# Altium schematic sheet GEARDRONE_F4_4.SchDoc
size A3
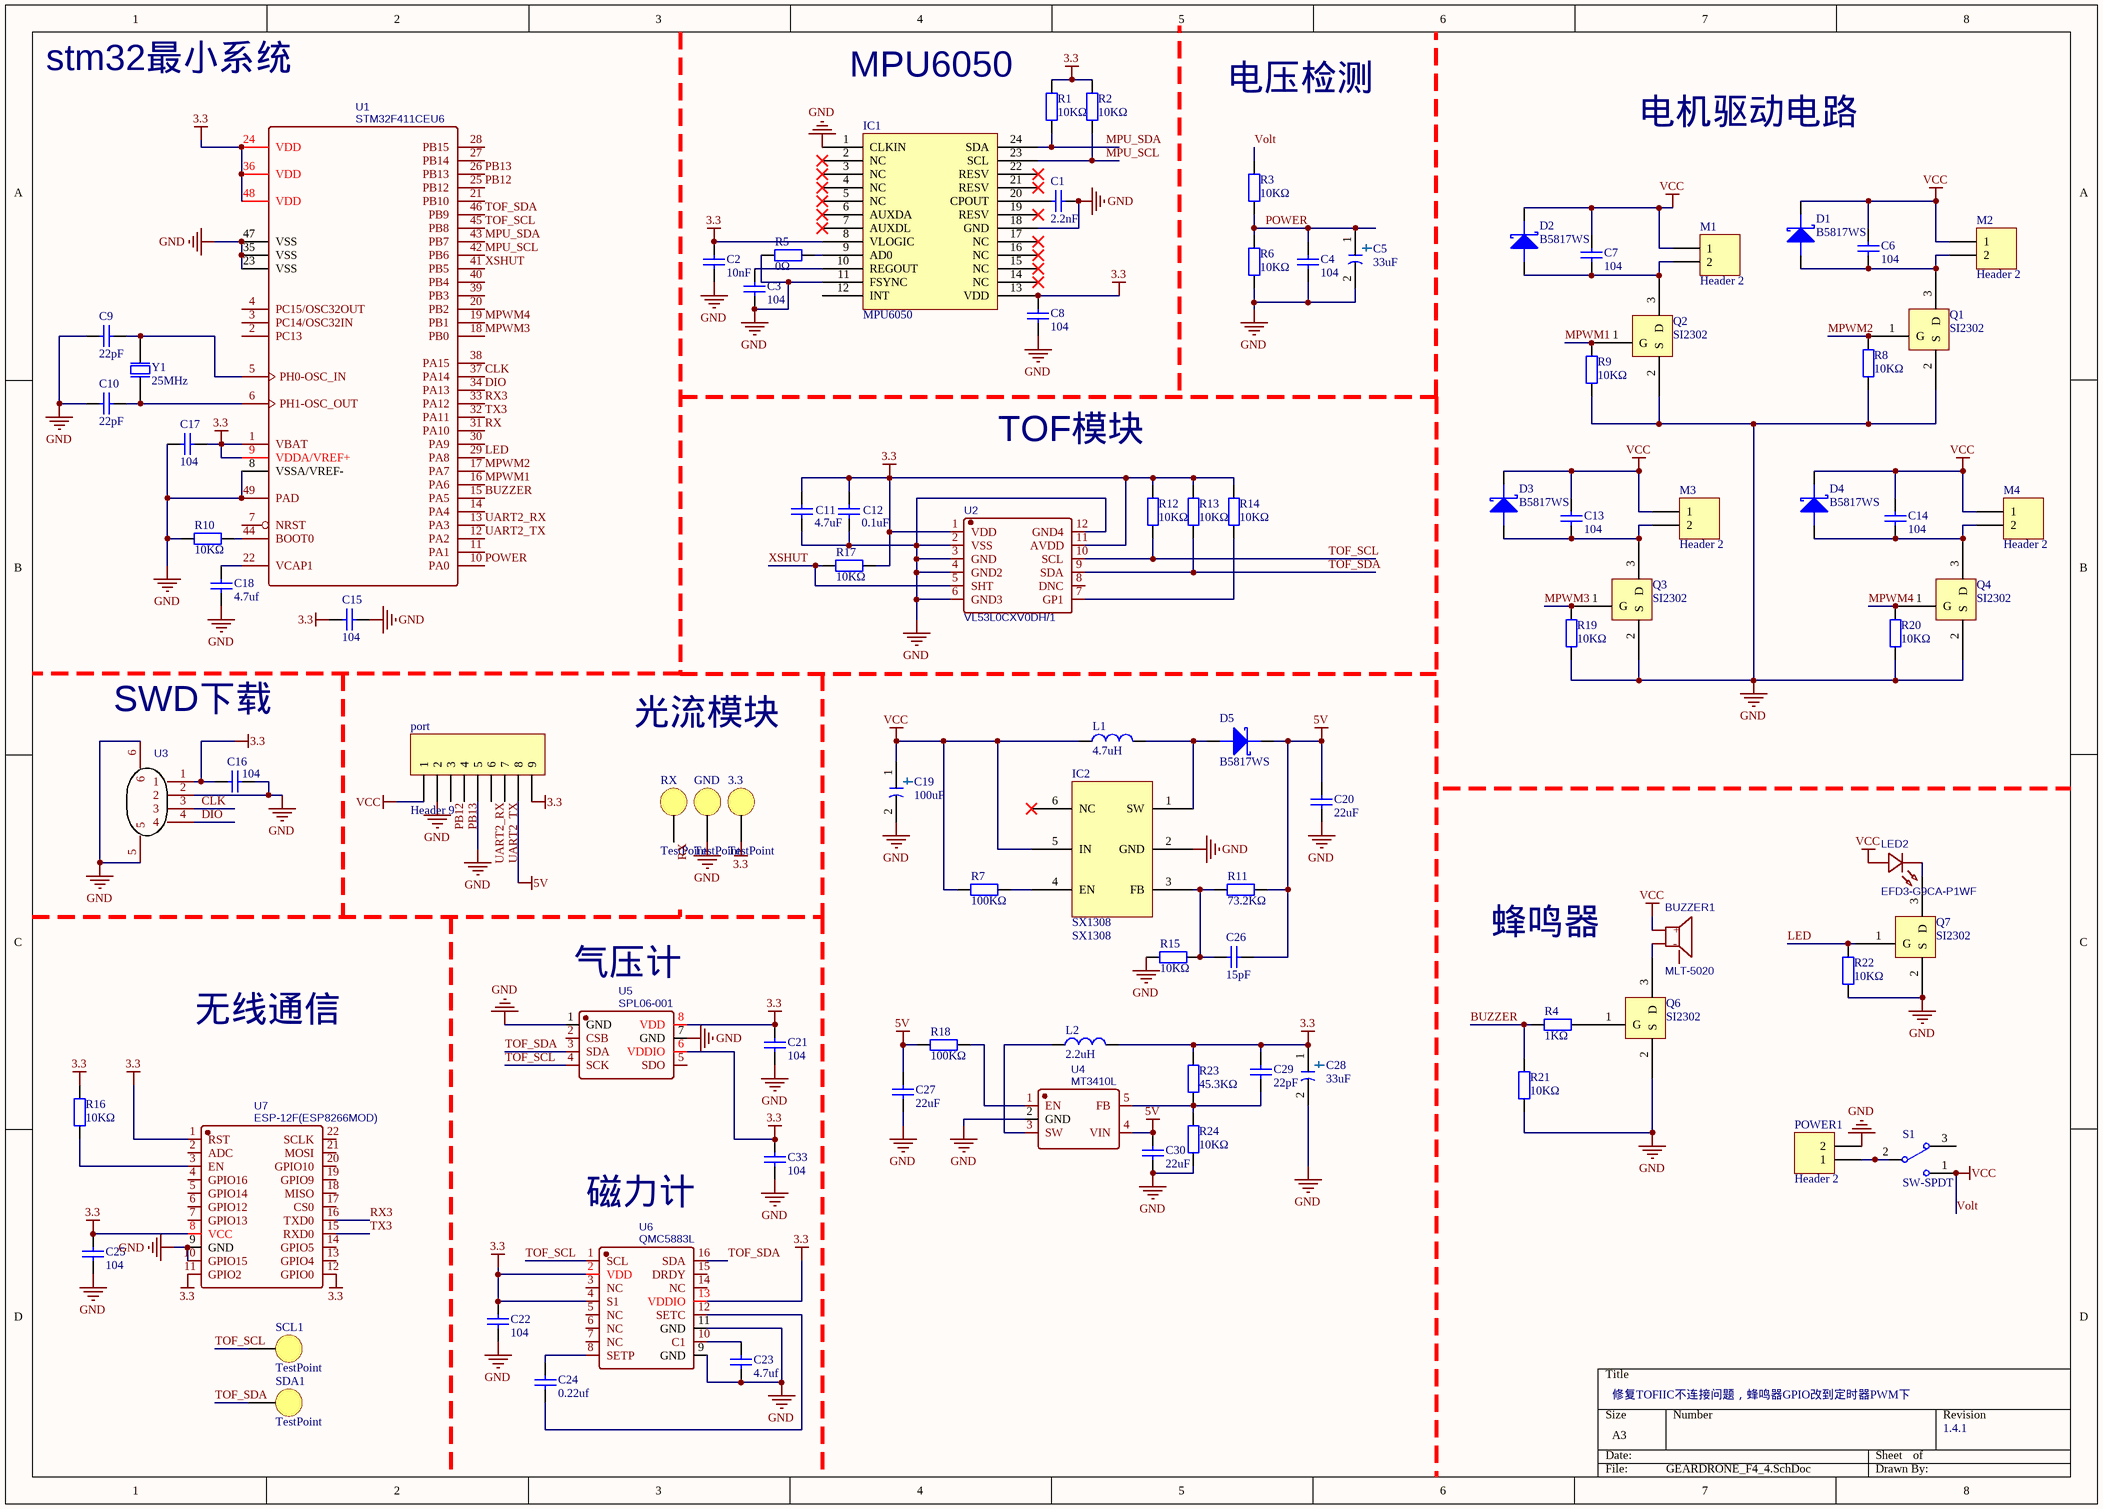
[diagram p0: GEARDRONE_F4_4.SchDoc]

## Parts
3.3  TestPoint  [TestPoint]
BUZZER1  MLT-5020  [BUZ-SMD_3P-L5.2-W5.2-P3.50-BR]
C1  2.2nf  [0603_C]
C2  10nf  [0603_C]
C3  104  [0603_C]
C4  104  [0603_C]
C5  33uf  [CASE-B_3528]
C6  104  [0603_C]
C7  104  [0603_C]
C8  104  [0603_C]
C9  22pf  [0603_C]
C10  22pf  [0603_C]
C11  4.7uf  [0603_C]
C12  0.1uf  [0603_C]
C13  104  [0603_C]
C14  104  [0603_C]
C15  104  [0603_C]
C16  104  [0603_C]
C17  104  [0603_C]
C18  4.7uf  [0603_C]
C19  100uf  [CASE-B_3528]
C20  22uf  [0603_C]
C21  104  [0603_C]
C22  104  [0603_C]
C23  4.7uf  [0603_C]
C24  0.22uf  [0603_C]
C25  104  [0603_C]
C26  15pf  [0603_C]
C27  22uF  [0603_C]
C28  33uf  [CASE-B_3528]
C29  22pF  [0603_C]
C30  22uF  [0603_C]
C33  104  [0603_C]
D1  B5817WS  [SOD-323]
D2  B5817WS  [SOD-323]
D3  B5817WS  [SOD-323]
D4  B5817WS  [SOD-323]
D5  B5817WS  [SOD-323]
GND  TestPoint  [TestPoint]
IC1  MPU6050  [LC-QFN-24_4x4x05P]
IC2  SX1308  [LC-SOT-23-6]
L1  4.7uH  [CD43NP]
L2  2.2uH  [IND-SMD_L3.0-W3.0]
LED2  EFD3-G9CA-P1WF  [LED3528]
M1  Header 2  [HDR1X2]
M2  Header 2  [HDR1X2]
M3  Header 2  [HDR1X2]
M4  Header 2  [HDR1X2]
port  Header 9  [HDR1X9]
POWER1  Header 2  [HDR1X2]
Q1  SI2302  [LC-SOT-23(SOT-23-3)]
Q2  SI2302  [LC-SOT-23(SOT-23-3)]
Q3  SI2302  [LC-SOT-23(SOT-23-3)]
Q4  SI2302  [LC-SOT-23(SOT-23-3)]
Q6  SI2302  [LC-SOT-23(SOT-23-3)]
Q7  SI2302  [LC-SOT-23(SOT-23-3)]
R1  value 10KΩ  [0603_R]  (hidden comment: 10k)
R2  value 10KΩ  [0603_R]  (hidden comment: 10k)
R3  value 10KΩ  [0603_R]  (hidden comment: 10k)
R4  value 1KΩ  [0603_R]  (hidden comment: 1k)
R5  value 0Ω  [0603_R]  (hidden comment: 0)
R6  value 10KΩ  [0603_R]  (hidden comment: 10k)
R7  value 100KΩ  [0603_R]  (hidden comment: 100k)
R8  value 10KΩ  [0603_R]  (hidden comment: 10k)
R9  value 10KΩ  [0603_R]  (hidden comment: 10k)
R10  10kΩ  [0603_R]
R11  value 73.2KΩ  [0603_R]  (hidden comment: 73.2k)
R12  value 10KΩ  [0603_R]  (hidden comment: 10k)
R13  value 10KΩ  [0603_R]  (hidden comment: 10k)
R14  value 10KΩ  [0603_R]  (hidden comment: 10k)
R15  value 10KΩ  [0603_R]  (hidden comment: 10k)
R16  value 10KΩ  [0603_R]  (hidden comment: 10k)
R17  value 10KΩ  [0603_R]  (hidden comment: 10k)
R18  value 100KΩ  [0603_R]  (hidden comment: 100k)
R19  value 10KΩ  [0603_R]  (hidden comment: 10k)
R20  value 10KΩ  [0603_R]  (hidden comment: 10k)
R21  value 10KΩ  [0603_R]  (hidden comment: 10k)
R22  value 10KΩ  [0603_R]  (hidden comment: 10k)
R23  45.3KΩ  [0603_R]
R24  10KΩ  [0603_R]
RX  TestPoint  [TestPoint]
S1  SW-SPDT  [8.5*3.5_3P]
SCL1  TestPoint  [TestPoint]
SDA1  TestPoint  [TestPoint]
U1  STM32F411CEU6  [UFQFPN-48_L7.0-W7.0-P0.50-BL-EP]
U2  VL53L0CXV0DH/1  [OPTO-SMD_12P_VL53L0CXV0DH-1]
U3  SM04B-GHS-TB(LF)(SN)  [CONN-SMD_4P-P1.25_SM04B-GHS-TB-LF-SN]  (value not drawn)
U4  MT3410L  [SOT-23-5_L2.9-W1.6-P0.95-LS2.8-BL]
U5  SPL06-001  [SENSOR-SMD_SPL06-001]
U6  QMC5883L  [LPCC-16_L3.0-W3.0-P0.50-BL]
U7  ESP-12F(ESP8266MOD)  [WIFIM-SMD_ESP-12F-ESP8266MOD]
Y1  Frequency: 25MHz  [SMD-5032_2P]  (hidden comment: 25MHZ 5032)

## Nets
3.3: 3.3.1(TestPoint) C2.2 C8.1 C11.2 C12.2 C15.2 C16.2 C17.1 C21.1 C22.1 C25.1 C28.1 C29.1 C33.1 IC1.8(VLOGIC) IC1.13(VDD) L2.2 port.9 R1.1 R2.1 R12.1 R13.1 R14.1 R16.1 R17.2 R23.2 U1.1(VBAT) U1.9(VDDA/VREF+) U1.24(VDD) U1.36(VDD) U1.48(VDD) U2.1(VDD) U2.11(AVDD) U3.1 U5.6(VDDIO) U5.8(VDD) U6.2(VDD) U6.4(S1) U6.13(VDDIO) U7.1(RST) U7.8(VCC) U7.11(GPIO2) U7.12(GPIO0)
5V: C20.2 C26.1 C27.2 C30.2 D5.2(K) port.8 R11.2 R18.1 U4.4(VIN)
GND: C1.2 C2.1 C3.2 C4.2 C5.2 C8.2 C9.1 C10.1 C11.1 C12.1 C15.1 C16.1 C17.2 C18.2 C19.2 C20.1 C21.2 C22.2 C23.1 C25.2 C27.1 C28.2 C30.1 C33.2 GND.1(TestPoint) IC1.1(CLKIN) IC1.11(FSYNC) IC1.18(GND) IC2.2(GND) port.2 port.5 POWER1.2 Q1.2(S) Q2.2(S) Q3.2(S) Q4.2(S) Q6.2(S) Q7.2(S) R5.1 R6.2 R8.2 R9.1 R10.1 R15.2 R19.2 R20.2 R21.1 R22.1 R24.1 U1.8(VSSA/VREF-) U1.23(VSS) U1.35(VSS) U1.47(VSS) U1.49(PAD) U2.2(VSS) U2.3(GND) U2.4(GND2) U2.6(GND3) U2.12(GND4) U3.2 U3.5 U3.6 U4.2(GND) U5.1(GND) U5.7(GND) U6.9(GND) U6.11(GND) U7.9(GND) U7.10(GPIO15)
Volt: BUZZER1.2(+) C6.2 C7.2 C13.2 C14.2 C19.1 D1.2(K) D2.2(K) D3.2(K) D4.2(K) IC2.5(IN) L1.1 LED2.2(A) M1.1 M2.1 M3.1 M4.1 port.1 R3.1 R7.1 S1.1  [also labelled VCC]
BUZZER: R4.2 R21.2 U1.15(PA5)
CLK: U1.37(PA14) U3.3
DIO: U1.34(PA13) U3.4
LED: Q7.1(G) R22.2 U1.29(PA8)
MPU_SCL: IC1.23(SCL) R2.2 U1.42(PB6)
MPU_SDA: IC1.24(SDA) R1.2 U1.43(PB7)
MPWM1: Q2.1(G) R9.2 U1.16(PA6)
MPWM2: Q1.1(G) R8.1 U1.17(PA7)
MPWM3: Q3.1(G) R19.1 U1.18(PB0)
MPWM4: Q4.1(G) R20.1 U1.19(PB1)
PB12: port.3 U1.25(PB12)
PB13: port.4 U1.26(PB13)
POWER: C4.1 C5.1 R3.2 R6.1 U1.10(PA0)
RX: RX.1(TestPoint) U1.31(PA10)
RX3: U1.33(PA12) U7.16(TXD0)
TOF_SCL: R12.2 SCL1.1(TestPoint) U1.45(PB8) U2.10(SCL) U5.4(SCK) U6.1(SCL)
TOF_SDA: R13.2 SDA1.1(TestPoint) U1.46(PB9) U2.9(SDA) U5.3(SDA) U6.16(SDA)
TX3: U1.32(PA11) U7.15(RXD0)
UART2_RX: port.6 U1.13(PA3)
UART2_TX: port.7 U1.12(PA2)
XSHUT: R17.1 U1.41(PB5) U2.5(SHT)
NetBUZZER1_3: BUZZER1.3(-) Q6.3(D)
NetC1_1: C1.1 IC1.20(CPOUT)
NetC3_1: C3.1 IC1.10(REGOUT)
NetC6_1: C6.1 D1.1(A) M2.2 Q1.3(D)
NetC7_1: C7.1 D2.1(A) M1.2 Q2.3(D)
NetC9_2: C9.2 U1.5(PH0-OSC_IN) Y1.2(OSC2)
NetC10_2: C10.2 U1.6(PH1-OSC_OUT) Y1.1(OSC1)
NetC13_1: C13.1 D3.1(A) M3.2 Q3.3(D)
NetC14_1: C14.1 D4.1(A) M4.2 Q4.3(D)
NetC18_1: C18.1 U1.22(VCAP1)
NetC23_2: C23.2 U6.10(C1)
NetC24_1: C24.1 U6.12(SETC)
NetC24_2: C24.2 U6.8(SETP)
NetC26_2: C26.2 IC2.3(FB) R11.1 R15.1
NetC29_2: C29.2 R23.1 R24.2 U4.5(FB)
NetD5_1: D5.1(A) IC2.1(SW) L1.2
NetIC1_9: IC1.9(AD0) R5.2
NetIC2_4: IC2.4(EN) R7.2
NetL2_1: L2.1 U4.3(SW)
NetLED2_1: LED2.1(K) Q7.3(D)
NetPOWER1_1: POWER1.1 S1.2
NetQ6_1: Q6.1(G) R4.1
NetR10_2: R10.2 U1.44(BOOT0)
NetR14_2: R14.2 U2.7(GP1)
NetR16_2: R16.2 U7.3(EN)
NetR18_2: R18.2 U4.1(EN)

Not connected (* = marked no-connect by the designer): BUZZER1 1(NC); IC1 2(NC)* 3(NC)* 4(NC)* 5(NC)* 6(AUXDA)* 7(AUXDL)* 12(INT) 14(NC)* 15(NC)* 16(NC)* 17(NC)* 19(RESV)* 21(RESV)* 22(RESV)*; IC2 6(NC)*; S1 3; U1 2(PC13) 3(PC14/OSC32IN) 4(PC15/OSC32OUT) 7(NRST) 11(PA1) 14(PA4) 20(PB2) 21(PB10) 27(PB14) 28(PB15) 30(PA9) 38(PA15) 39(PB3) 40(PB4); U2 8(DNC); U5 2(CSB) 5(SDO); U6 3(NC) 5(NC) 6(NC) 7(NC) 14(NC) 15(DRDY); U7 2(ADC) 4(GPIO16) 5(GPIO14) 6(GPIO12) 7(GPIO13) 13(GPIO4) 14(GPIO5) 17(CS0) 18(MISO) 19(GPIO9) 20(GPIO10) 21(MOSI) 22(SCLK)

## Notes on the sheet
- stm32最小系统
- MPU6050
- 电压检测
- 电机驱动电路
- TOF模块
- SWD下载
- 光流模块
- (near U5) 气压计
- 蜂鸣器
- 无线通信
- (near U6) 磁力计
- 修复TOFIIC不连接问题，蜂鸣器GPIO改到定时器PWM下
- 1.4.1
- (in symbol ECAP) 100uF; 33uF

## Library data of the parts
BUZZER1 = MLT-5020: BOM_Manufacturer: HNDZ; BOM_Supplier: LCSC; BOM_Manufacturer Part: MLT-5020; BOM_Supplier Part: C94598; BOM_JLCPCB Part Class: Extended Part; spicePre: B; spiceSymbolName: MLT-5020
C1-C4 C6-C8 C11-C18 C20-C27 C29 C30 C33 = Cap Chip 0603: Polarized Capacitor (Radial); Published: 8-Jun-2000; Revision: July-2002: Re-released for DXP Platform.; Publisher: Altium Limited
  C1: Value: 2.2nF
  C2: Value: 10nF
  C3 C4 C6-C8 C13-C17 C21 C22 C25 C33: Value: 104
  C11: Value: 4.7uF
  C12: Value: 0.1uF
  C18 C23: Value: 4.7uf
  C20 C27 C30: Value: 22uF
  C24: Value: 0.22uf
  C26: Value: 15pF
  C29: Value: 22pF
C5 C19 C28 = ECAP
C9 C10 = Cap Chip 0805: Polarized Capacitor (Radial); Published: 8-Jun-2000; Revision: July-2002: Re-released for DXP Platform.; Publisher: Altium Limited; Value: 22pF
D1-D5 = DIODE-TVS
IC1 = MPU6050: 三轴陀螺仪
L1 L2 = Inductor Chip: Inductor; Published: 8-Jun-2000; Revision: July-2002: Re-released for DXP Platform.; Publisher: Altium Limited
  L1: Value: 4.7uH
  L2: Value: 2.2uH
LED2 = EFD3-G9CA-P1WF: BOM_Manufacturer: APt; Contributor: LCSC; BOM_Supplier: LCSC; BOM_Supplier Part: C507038; BOM_Manufacturer Part: EFD3-G9CA-P1WF; BOM_JLCPCB Part Class: Extended Part; spicePre: L; spiceSymbolName: EFD3-G9CA-P1WF
M1-M4 POWER1 = Header 2: Header, 2-Pin; LatestRevisionDate: 17-Jul-2002; LatestRevisionNote: Re-released for DXP Platform.; Publisher: Altium Limited
port = Header 9: Header, 9-Pin; LatestRevisionDate: 17-Jul-2002; LatestRevisionNote: Re-released for DXP Platform.; Publisher: Altium Limited
Q1-Q4 Q6 Q7 = HANDSOME-SI2302-N
R1-R24 = Resistor Chip 0805: Resistor; Published: 8-Jun-2000; Revision: July-2002: Re-released for DXP Platform.; Publisher: Altium Limited
  R10 R24: Value: 10KΩ
  R23: Value: 45.3KΩ
S1 = SW-SPDT: SPDT Subminiature Toggle Switch, Right Angle Mounting, Vertical Actuation; Revision 1: Jul-2002: Re-released for DXP Platform.; Revision 2: 17-Dec-2003: Schematic revised, PCB Footprint replaced.; Published: 24-Mar-1999; Datasheet: Latest Revision: 05-Dec-2000; Publisher: Altium Limited
U1 = STM32F411CEU6: BOM_Manufacturer: STMicroelectronics; BOM_Supplier: LCSC; BOM_Manufacturer Part: STM32F411CEU6; BOM_Supplier Part: C60420; BOM_JLCPCB Part Class: Extended Part; spicePre: U; spiceSymbolName: STM32F411CEU6
U2 = VL53L0CXV0DH/1: BOM_Manufacturer: STMicroelectronics; BOM_Supplier: LCSC; BOM_Manufacturer Part: VL53L0CXV0DH/1; BOM_Supplier Part: C91199; BOM_JLCPCB Part Class: Extended Part; spicePre: U; spiceSymbolName: VL53L0CXV0DH/1
U3 = SM04B-GHS-TB(LF)(SN): BOM_Manufacturer: JST Sales America; Contributor: LCSC; BOM_Supplier: LCSC; BOM_Supplier Part: C189895; BOM_Manufacturer Part: SM04B-GHS-TB(LF)(SN); BOM_JLCPCB Part Class: Extended Part; spicePre: U; spiceSymbolName: SM04B-GHS-TB(LF)(SN)
U4 = MT3410L: BOM_Manufacturer: AEROSEMI; BOM_Supplier: LCSC; BOM_Manufacturer Part: MT3410L; BOM_Supplier Part: C83223; BOM_JLCPCB Part Class: Extended Part; spicePre: U; spiceSymbolName: MT3410L
U5 = SPL06-001: BOM_Manufacturer: Goertek(歌尔); Contributor: LCSC; BOM_Supplier: LCSC; BOM_Supplier Part: C2684428; BOM_Manufacturer Part: SPL06-001; BOM_JLCPCB Part Class: Extended Part; spicePre: U; spiceSymbolName: SPL06-001
U6 = HMC5883L: BOM_Manufacturer: null; Contributor: LCSC; BOM_Supplier: LCSC; BOM_Supplier Part: C2859540; BOM_Manufacturer Part: HMC5883L; BOM_JLCPCB Part Class: Extended Part; spicePre: U; spiceSymbolName: HMC5883L
U7 = ESP-12F(ESP8266MOD): BOM_Manufacturer: Ai-Thinker; BOM_Supplier: LCSC; BOM_Manufacturer Part: ESP-12F(ESP8266MOD); BOM_Supplier Part: C82891; BOM_JLCPCB Part Class: Extended Part; spicePre: U; spiceSymbolName: ESP-12F(ESP8266MOD)
Y1 = XTAL: Crystal Oscillator; Published: 8-Jun-2000; Revision: July-2002: Re-released for DXP Platform.; Publisher: Altium Limited